# Altium project CPCIS_PWR_MOD_DC.PrjPCB (part 2 of 2)

## Sheet PWR_Stage.SchDoc
size 420 x 297 mm
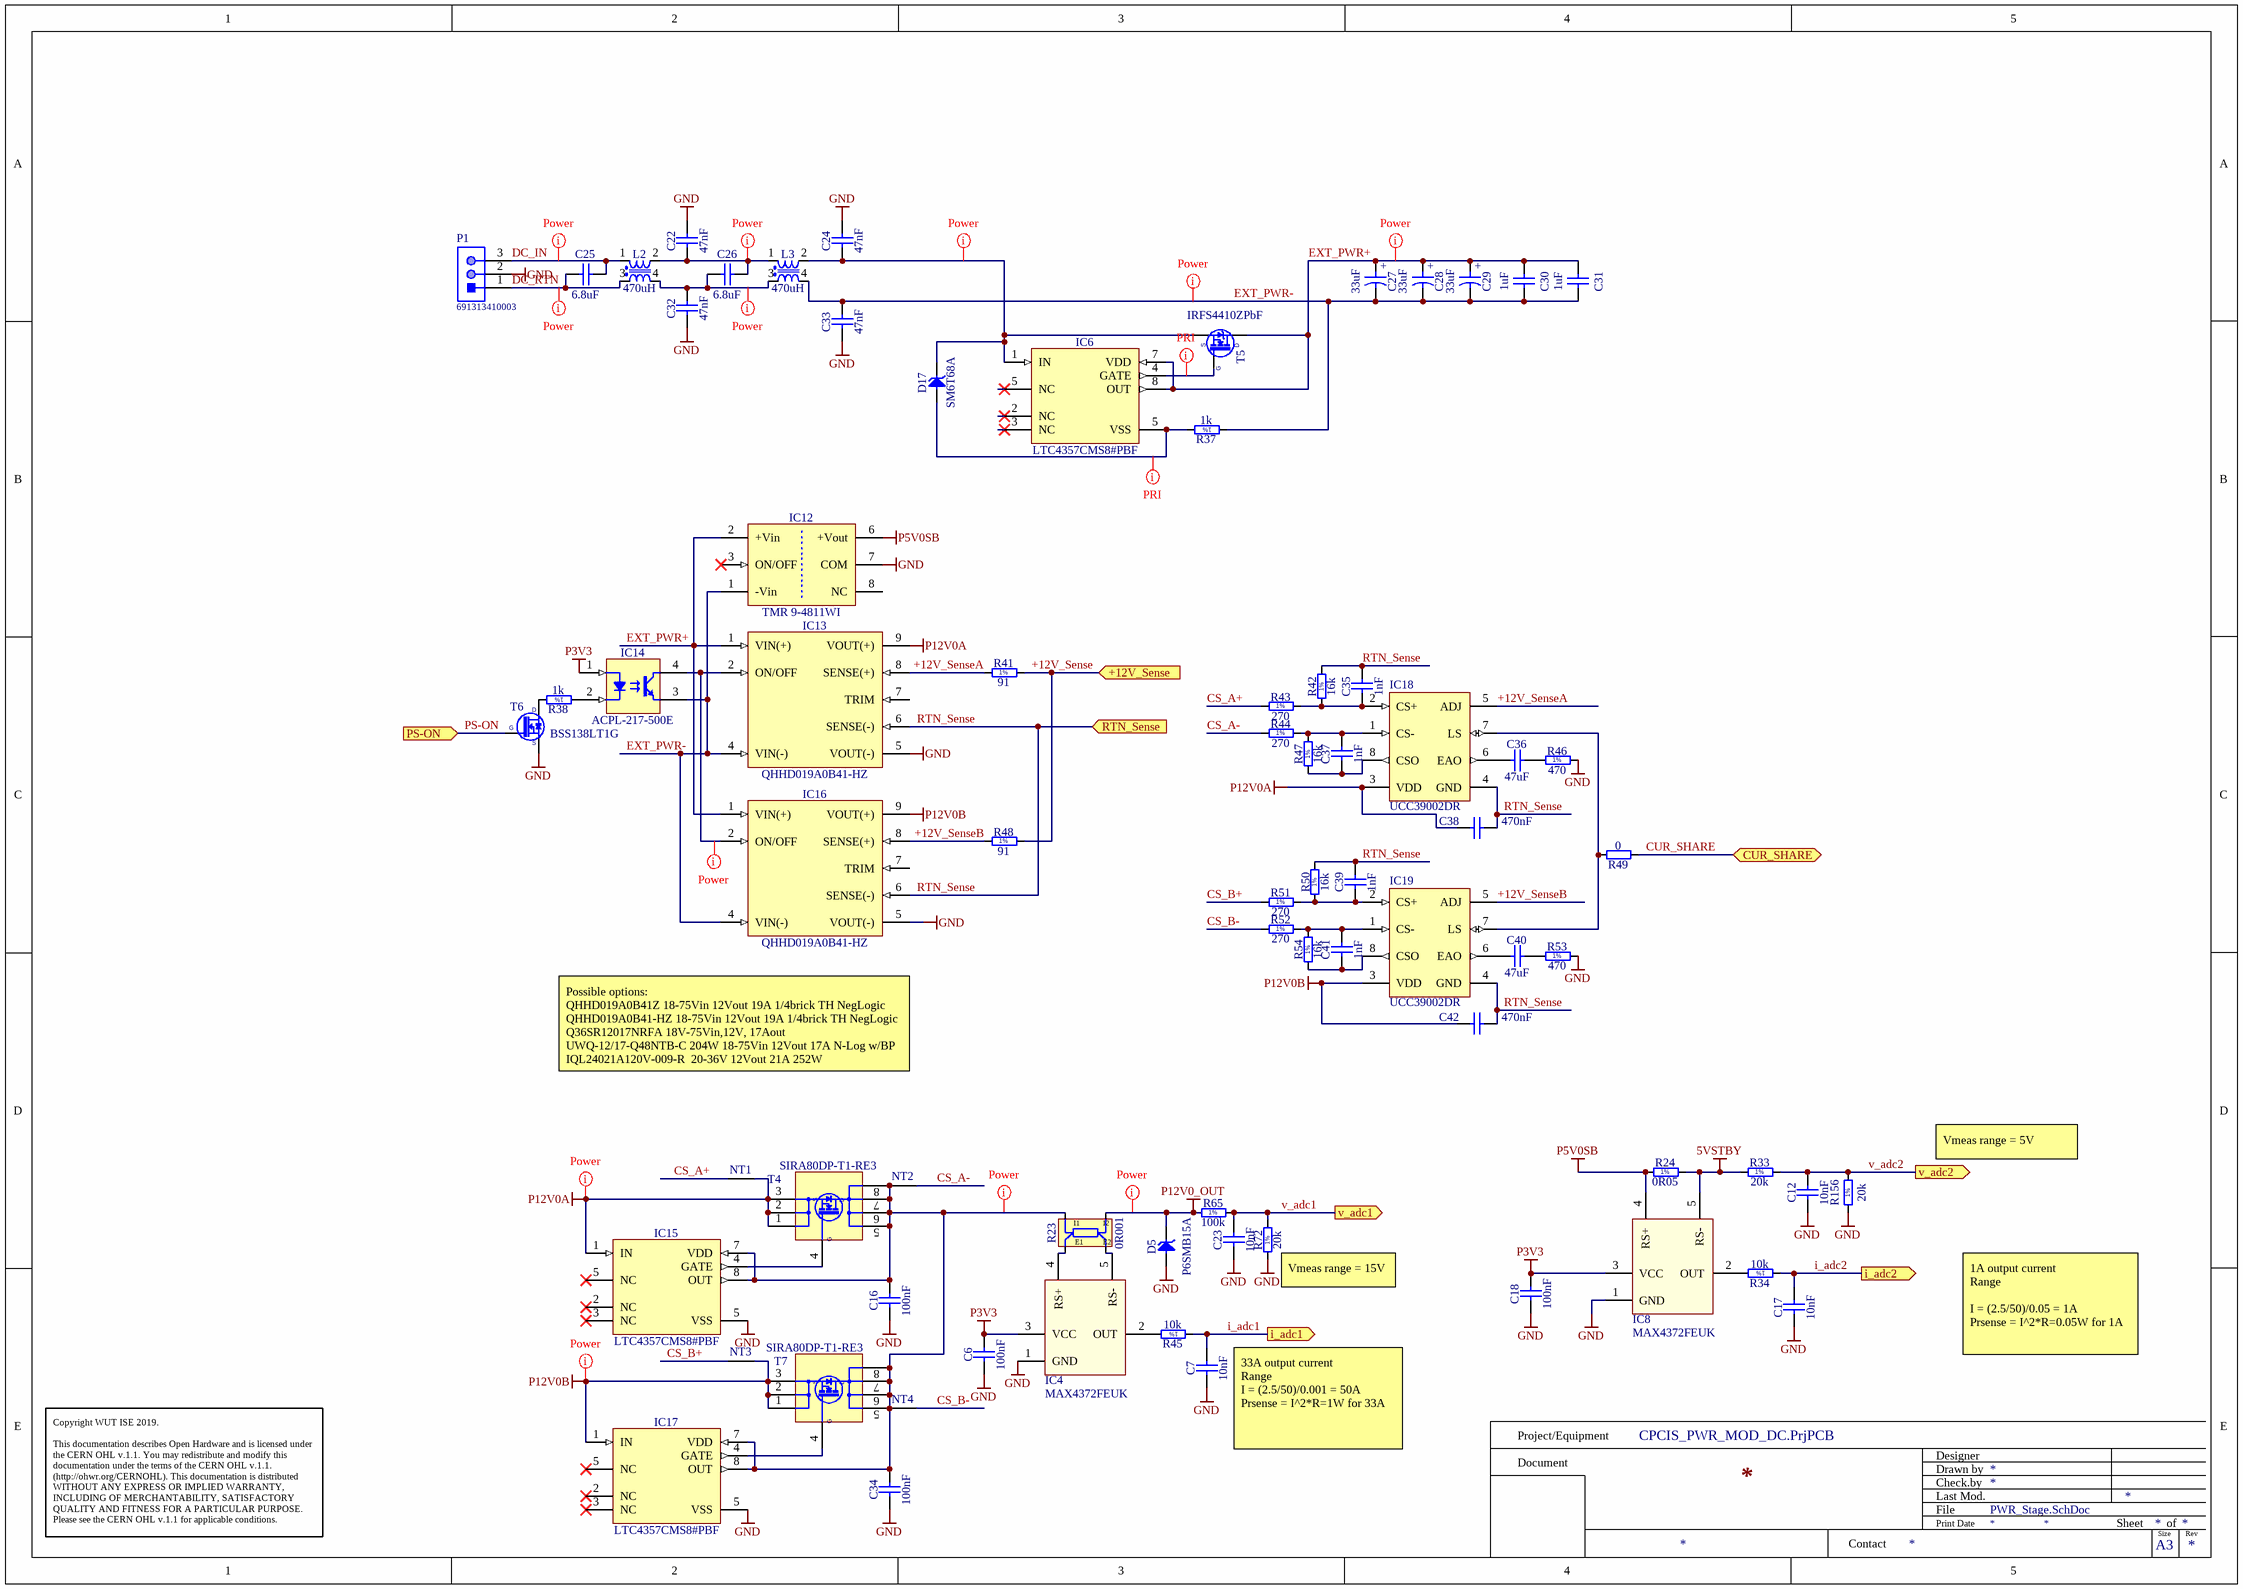
[diagram p1: PWR_Stage.SchDoc]

### Parts
C6  100nF  [CAPC1005X55N]
C7  10nF  [CAPC1005X55N]
C12  10nF  [CAPC1005X55N]
C16  100nF  [CAPC1005X55N]
C17  10nF  [CAPC1005X55N]
C18  100nF  [CAPC1005X55N]
C22  47nF  [CAPR1500-500X1800X1050]
C23  10nF  [CAPC1005X55N]
C24  47nF  [CAPR1500-500X1800X1050]
C25  6.8uF  [CAPR2750-1500X3150X2600]
C26  6.8uF  [CAPR2750-1500X3150X2600]
C27  33uF  [CAPPR500-1050X1350]
C28  33uF  [CAPPR500-1050X1350]
C29  33uF  [CAPPR500-1050X1350]
C30  1uF  [CAPR1000-520X1320X1200]
C31  1uF  [CAPR1000-520X1320X1200]
C32  47nF  [CAPR1500-500X1800X1050]
C33  47nF  [CAPR1500-500X1800X1050]
C34  100nF  [CAPC1005X55N]
C35  1nF  [CAPC1005X55N]
C36  47uF  [CAPC1608X100N]
C37  1nF  [CAPC1005X55N]
C38  470nF  [CAPC1608X87N]
C39  1nF  [CAPC1005X55N]
C40  47uF  [CAPC1608X100N]
C41  1nF  [CAPC1005X55N]
C42  470nF  [CAPC1608X87N]
D5  P6SMB15A  [DIOM5436X261N]
D17  SM6T68A  [DIOM5436X265N]
IC4  MAX4372FEUK  [SOT95P270X145-5N]
IC6  LTC4357CMS8#PBF  [SOP65P490X110-8N]
IC8  MAX4372FEUK  [SOT95P270X145-5N]
IC12  TMR 9-4811WI  [DCDC_TRACO_TMR9WI]
IC13  QHHD019A0B41-HZ  [DCDC_quad_brick]
IC14  ACPL-217-500E  [SOIC127P700X242-4N]
IC15  LTC4357CMS8#PBF  [SOP65P490X110-8N]
IC16  QHHD019A0B41-HZ  [DCDC_quad_brick]
IC17  LTC4357CMS8#PBF  [SOP65P490X110-8N]
IC18  UCC39002DR  [D0008A_N]
IC19  UCC39002DR  [D0008A_N]
L2  470uH  [IND_PULSE_BIG FOOT]
L3  470uH  [IND_PULSE_BIG FOOT]
NT1  Net Tie  [Net Tie]  (value not drawn)  (net tie, no BOM)
NT2  Net Tie  [Net Tie]  (value not drawn)  (net tie, no BOM)
NT3  Net Tie  [Net Tie]  (value not drawn)  (net tie, no BOM)
NT4  Net Tie  [Net Tie]  (value not drawn)  (net tie, no BOM)
P1  691313410003  [691313410003]
R23  0R001  [RES_VISHAY_WSL3637_0R001-0R0019]
R24  0R05  [RESC2012X60N]
R33  20k  [RESC1005X40N]
R34  10k  [RESC1005X40N]
R37  1k  [RESC3216X65N]
R38  1k  [RESC1005X40N]
R41  91  [RESC1608X55N]
R42  16k  [RESC1608X55N]
R43  270  [RESC1608X55N]
R44  270  [RESC1608X55N]
R45  10k  [RESC1005X40N]
R46  470  [RESC1005X40N]
R47  16k  [RESC1608X55N]
R48  91  [RESC1608X55N]
R49  0  [RESC1608X55N]
R50  16k  [RESC1608X55N]
R51  270  [RESC1608X55N]
R52  270  [RESC1608X55N]
R53  470  [RESC1005X40N]
R54  16k  [RESC1608X55N]
R65  100k  [RESC1005X40N]
R72  20k  [RESC1005X40N]
R156  20k  [RESC1005X40N]
T4  SIRA80DP-T1-RE3  [VISHAY_POWERPAK-SO-8-SINGLE]
T5  IRFS4410ZPbF  [TO254P1524X483-3N-R1067X686]
T6  BSS138LT1G  [SOT95P240X110-3N]
T7  SIRA80DP-T1-RE3  [VISHAY_POWERPAK-SO-8-SINGLE]

### Ports
+12V_Sense (in), CUR_SHARE (bidir), i_adc1 (out), i_adc2 (out), PS-ON (in), RTN_Sense (in), v_adc1 (out), v_adc2 (out)

### Nets
5VSTBY: IC8.5(RS-) R24.2 R33.1
GND: C6.1 C7.1 C12.1 C16.1 C17.1 C18.1 C22.2 C23.1 C24.2 C32.1 C33.1 C34.1 D5.2(A) IC4.1(GND) IC8.1(GND) IC12.7(COM) IC13.5(VOUT(-)) IC15.5(NC) IC16.5(VOUT(-)) IC17.5(NC) P1.2 R46.2 R53.2 R72.1 R156.1 T6.2(S)
P3V3: C6.2 C18.2 IC4.3(VCC) IC8.3(VCC) IC14.1(A)
P5V0SB: IC8.4(RS+) IC12.6(+Vout) R24.1
P12V0_OUT: D5.1(C) R23.I2 R65.1
P12V0A: C38.2 IC13.9(VOUT(+)) IC15.1(IN) IC18.3(VDD) NT1.2 T4.1(S) T4.2(S) T4.3(S)
P12V0B: C42.2 IC16.9(VOUT(+)) IC17.1(IN) IC19.3(VDD) NT3.2 T7.1(S) T7.2(S) T7.3(S)
+12V_Sense: R41.2 R48.2 ; port +12V_Sense
+12V_SenseA: IC13.8(SENSE(+)) IC18.5(ADJ) R41.1
+12V_SenseB: IC16.8(SENSE(+)) IC19.5(ADJ) R48.1
CS_A+: NT1.1 R43.1
CS_A-: NT2.2 R44.1
CS_B+: NT3.1 R51.1
CS_B-: NT4.2 R52.1
CUR_SHARE: R49.1 ; port CUR_SHARE
DC_IN: C25.2 L2.1 P1.3
DC_RTN: C25.1 L2.3 P1.1
EXT_PWR+: C27.1 C28.1 C29.1 C30.1 C31.1 IC6.7(VDD) IC6.8(OUT) IC12.2(+Vin) IC13.1(VIN(+)) IC16.1(VIN(+)) T5.3(D)
EXT_PWR-: C27.2 C28.2 C29.2 C30.2 C31.2 C33.2 IC12.1(-Vin) IC13.4(VIN(-)) IC14.3(E) IC16.4(VIN(-)) L3.4 R37.1
i_adc1: C7.2 R45.1 ; port i_adc1
i_adc2: C17.2 R34.1 ; port i_adc2
PS-ON: T6.1(G) ; port PS-ON
RTN_Sense: C35.2 C38.1 C39.2 C42.1 IC13.6(SENSE(-)) IC16.6(SENSE(-)) IC18.4(GND) IC19.4(GND) R42.2 R50.2 ; port RTN_Sense
v_adc1: C23.2 R65.2 R72.2 ; port v_adc1
v_adc2: C12.2 R33.2 R156.2 ; port v_adc2
NetC16_2: C16.2 C34.2 IC15.7(VDD) IC15.8(OUT) IC17.7(VDD) IC17.8(OUT) NT2.1 NT4.1 R23.I1 T4.D T7.D
NetC22_1: C22.1 C26.2 L2.2 L3.1
NetC24_1: C24.1 D17.1(C) IC6.1(IN) L3.2 T5.2(S)
NetC26_1: C26.1 C32.2 L2.4 L3.3
NetC35_1: C35.1 IC18.2(CS+) R42.1 R43.2
NetC36_1: C36.1 IC18.6(EAO)
NetC36_2: C36.2 R46.1
NetC37_1: C37.1 IC18.8(CSO) R47.1
NetC37_2: C37.2 IC18.1(CS-) R44.2 R47.2
NetC39_1: C39.1 IC19.2(CS+) R50.1 R51.2
NetC40_1: C40.1 IC19.6(EAO)
NetC40_2: C40.2 R53.1
NetC41_1: C41.1 IC19.8(CSO) R54.1
NetC41_2: C41.2 IC19.1(CS-) R52.2 R54.2
NetD17_2: D17.2(A) IC6.5(NC) R37.2
NetIC4_2: IC4.2(OUT) R45.2
NetIC4_4: IC4.4(RS+) R23.E1
NetIC4_5: IC4.5(RS-) R23.E2
NetIC6_4: IC6.4(GATE) T5.1(G)
NetIC8_2: IC8.2(OUT) R34.2
NetIC13_2: IC13.2(ON/OFF) IC14.4(C) IC16.2(ON/OFF)
NetIC14_2: IC14.2(C) R38.1
NetIC15_4: IC15.4(GATE) T4.4(S)
NetIC17_4: IC17.4(GATE) T7.4(S)
NetIC18_7: IC18.7(LS) IC19.7(LS) R49.2
NetR38_2: R38.2 T6.3(D)

Not connected (* = marked no-connect by the designer): IC6 2(NC)* 3(NC)*; IC12 3(ON/OFF)* 8(NC); IC13 7(TRIM); IC15 2(NC)* 3(NC)*; IC16 7(TRIM); IC17 2(NC)* 3(NC)*

### Layout directives
net class Power: NetC16_2, P12V0_OUT, P12V0A, P12V0B
net class Power; net class PRI: DC_IN, DC_RTN, EXT_PWR+, EXT_PWR-, NetC22_1, NetC24_1, NetC26_1, NetIC13_2
net class PRI: NetD17_2, NetIC6_4

### Notes on the sheet
- Possible options:
  QHHD019A0B41Z 18-75Vin 12Vout 19A 1/4brick TH NegLogic
  QHHD019A0B41-HZ 18-75Vin 12Vout 19A 1/4brick TH NegLogic
  Q36SR12017NRFA 18V-75Vin,12V, 17Aout
  UWQ-12/17-Q48NTB-C 204W 18-75Vin 12Vout 17A N-Log w/BP
  IQL24021A120V-009-R  20-36V 12Vout 21A 252W
- Vmeas range = 5V
- (near R72) Vmeas range = 15V
- 1A output current
  Range
  I = (2.5/50)/0.05 = 1A
  Prsense = I^2*R=0.05W for 1A
- (near C7) 33A output current
  Range
  I = (2.5/50)/0.001 = 50A
  Prsense = I^2*R=1W for 33A
- Project/Equipment
- Document
- Designer
- Drawn by
- Check.by
- Copyright WUT ISE 2019.
  This documentation describes Open Hardware and is licensed under the CERN OHL v.1.1. You may redistribute and modify this documentation under the terms of the CERN OHL v.1.1. (http://ohwr.org/CERNOHL). This documentation is distributed WITHOUT ANY EXPRESS OR IMPLIED WARRANTY, INCLUDING OF MERCHANTABILITY, SATISFACTORY QUALITY AND FITNESS FOR A PARTICULAR PURPOSE. Please see the CERN OHL v.1.1 for applicable conditions.
- Contact
- File
- Last Mod.
- Print Date
- Sheet
- Size
- A3
- of
- Rev
- (in symbol CAER_33UF_100V_20%_PANASONIC_EEUFC2A330) +
- (in symbol Q_SIRA80DP-T1-RE3) 7; 6; G; 5
- (in symbol R0402_1K_1%_0.0625W_100PPM) 1%
- (in symbol R0402_10K_1%_0.0625W_100PPM) 1%
- (in symbol R0402_20K_1%_0.0625W_100PPM) 1%
- (in symbol R0402_100K_1%_0.0625W_100PPM) 1%
- (in symbol R0402_470R_1%_0.0625W_100PPM) 1%
- (in symbol R0603_16K_1%_0.1W_100PPM) 1%
- (in symbol R0603_91R_1%_0.1W_100PPM) 1%
- (in symbol R0603_270R_1%_0.1W_100PPM) 1%
- (in symbol R0805_0R05_1%_0.25W_300PPM) 1%
- (in symbol R1206_1K_1%_0.25W_100PPM) 1%

### Library data of the parts
C6 C16 C18 C34 = CC0402_100NF_25V_10%_X7R_YUDEN_TMK105B7104KVHF: Non-polarised capacitor; Part Description: SMD Multilayer Chip Ceramic Capacitor (High Dielectric Type) for Automotive / Industrial Applications; Manufacturer: TAIYO YUDEN; Voltage: 25V; TC: X7R; Tolerance: ±10%; Part Number: CC0402_100NF_25V_10%_X7R_YUDEN_TMK105B7104KVHF; Component Kind: Standard; Component Type: Standard; Pin Count: 2; Value: 100nF; Status: Not Recommended; Manufacturer Part Number: TMK105B7104KVHF; Case: 0402; Mounted: Yes; Socket: No; SMD: Yes; Sense: No; HelpURL: \\cern.ch\dfs\Applications\Altium\Datasheets\CC0402_TAIYO-YUDEN_TMK105B7104KVHF.pdf; Author: CERN DEM JLC; CreateDate: 10/05/2017; LatestRevisionDate: 10/05/2017; ComponentHeight: 0.55mm
C7 C12 C17 C23 = CC0402_10NF_50V_10%_X7R: Non-polarised capacitor; Part Description: SMD Multilayer Chip Ceramic Capacitor; Manufacturer: GENERIC; Manufacturer1 Part Number: GRM155R71H103KA88D; Voltage: 50V; TC: X7R; Tolerance: ±10%; Part Number: CC0402_10NF_50V_10%_X7R; Component Kind: Standard; Component Type: Standard; Pin Count: 2; Value: 10nF; Status: None; Manufacturer Part Number: CC0402_10NF_50V_10%_X7R; Case: 0402; Mounted: Yes; Socket: No; SMD: Yes; Sense: No; Manufacturer1 Example: MURATA; Manufacturer1 ComponentHeight: 0.55mm; HelpURL: \\cern.ch\dfs\Applications\Altium\Datasheets\CC0402_X7R_MURATA_GRM.pdf; Author: CERN DEM MR; CreateDate: 08/01/2016; LatestRevisionDate: 08/01/2016
C22 C24 C32 C33 = CPPR_47NF_630V_5%_1500-500X1800X1050: Non-polarised capacitor; Part Description: Metallized Polypropylene Film Capacitor (MKP); Manufacturer: TDK; Manufacturer Part Number: B32652A6473J000; Voltage: 630VDC/250VAC; Tolerance: ±5%; Part Number: CPPR_47NF_630V_5%_1500-500X1800X1050; Component Kind: Standard; Component Type: Standard; Pin Count: 2; Value: 47nF; Status: None; Case: LS15 W5 x L18 x H10.5; Mounted: Yes; Socket: No; SMD: No; Sense: No; ComponentHeight: 10.5mm; HelpURL: \\cern.ch\dfs\Applications\Altium\Datasheets\CPPR_TDK_B32652.pdf; Author: CERN DEM JLC; CreateDate: 20.12.2007; LatestRevisionDate: 22.04.2015
C25 C26 = CPPR_6.8UF_100V_20%_2750-1500X3150X2600: Non-polarised capacitor; Part Description: Metallized Polypropylene Film Capacitor (MKP4); Manufacturer: WIMA; Manufacturer Part Number: MKP4D046806F00MSSD; Voltage: 100VDC/63VAC; Tolerance: ±20%; Part Number: CPPR_6.8UF_100V_20%_2750-1500X3150X2600; Component Kind: Standard; Component Type: Standard; Pin Count: 2; Value: 6.8uF; Status: None; Case: LS27.5 W15 x L31.5 x H26; Mounted: Yes; Socket: No; SMD: No; Sense: No; ComponentHeight: 26mm; HelpURL: \\cern.ch\dfs\Applications\Altium\Datasheets\CPPR_WIMA_MKP4.pdf; Author: CERN DEM JLC; CreateDate: 12.05.2014; LatestRevisionDate: 12.05.2014
C27-C29 = CAER_33UF_100V_20%_PANASONIC_EEUFC2A330: Polarised capacitor; Part Description: Z= 0R53, Radial Lead, Aluminum Electrolytic Capacitor, (FC Series, Type A, Automotive Compliant); Voltage: 100V; Tolerance: ±20%; Part Number: CAER_33UF_100V_20%_PANASONIC_EEUFC2A330; Component Kind: Standard; Component Type: Standard; Pin Count: 2; Value: 33uF; Status: None; Manufacturer: PANASONIC; Manufacturer Part Number: EEUFC2A330; Case: LS5 D10 x H12.5; Mounted: Yes; Socket: No; SMD: No; Sense: No; ComponentHeight: 13.5mm; HelpURL: \\cern.ch\dfs\Applications\Altium\Datasheets\CAER_PANASONIC_FC-A.pdf; Author: CERN DEM JLC; CreateDate: 22.03.2016; LatestRevisionDate: 23.01.2018
C30 C31 = CPER_1UF_100V_5%_KEMET_R60: Non-polarised capacitor; Part Description: Metallized Polyester Film Capacitor; Manufacturer: KEMET; Manufacturer Part Number: R60EF4100506AJ; Voltage: 100V; Tolerance: ±5%; Part Number: CPER_1UF_100V_5%_KEMET_R60; Component Kind: Standard; Component Type: Standard; Pin Count: 2; Value: 1uF; Status: None; Case: LS10 W5 x L13 x H11; Mounted: Yes; Socket: No; SMD: No; Sense: No; ComponentHeight: 12mm; HelpURL: \\cern.ch\dfs\Applications\Altium\Datasheets\CPER_KEMET_R60.pdf; Author: CERN DEM JLC; CreateDate: 11.02.2015; LatestRevisionDate: 11.02.2015
C35 C37 C39 C41 = CC0402_1NF_50V_10%_X7R: Non-polarised capacitor; Part Description: SMD Multilayer Chip Ceramic Capacitor; Manufacturer: GENERIC; Manufacturer1 Part Number: 223858715623; Voltage: 50V; TC: X7R; Tolerance: ±10%; Part Number: CC0402_1NF_50V_10%_X7R; Component Kind: Standard; Component Type: Standard; Pin Count: 2; Value: 1nF; Status: Not Recommended; Manufacturer Part Number: CC0402_1NF_50V_10%_X7R; Case: 0402; Mounted: Yes; Socket: No; SMD: Yes; Sense: No; Manufacturer1 Example: PHYCOMP; Manufacturer1 ComponentHeight: 0.55mm; HelpURL: \\cern.ch\dfs\Applications\Altium\Datasheets\CC0402_X7R_PHYCOMP.pdf; Author: CERN DEM JLC; CreateDate: 03.12.2007; LatestRevisionDate: 03.12.2007
C36 C40 = CC0603_47UF_6.3V_20%_X5R: Non-polarised capacitor; Part Description: SMD Multilayer Chip Ceramic Capacitor; Manufacturer: GENERIC; Manufacturer1 Part Number: GRM188R60J476ME15D; Voltage: 6.3V; TC: X5R; Tolerance: ±20%; Part Number: CC0603_47UF_6.3V_20%_X5R; Component Kind: Standard; Component Type: Standard; Pin Count: 2; Value: 47uF; Status: None; Manufacturer Part Number: CC0603_47UF_6.3V_20%_X5R; Case: 0603; Mounted: Yes; Socket: No; SMD: Yes; Sense: No; Manufacturer1 Example: MURATA; Manufacturer1 ComponentHeight: 1mm; HelpURL: \\cern.ch\dfs\Applications\Altium\Datasheets\CC0603_MURATA_GRM188R60J476ME15D.pdf; Author: CERN DEM JLC; CreateDate: 01.02.2018; LatestRevisionDate: 01.02.2018
C38 C42 = CC0603_470NF_50V_10%_X5R: Non-polarised capacitor; Part Description: SMD Multilayer Chip Ceramic Capacitor; Manufacturer: GENERIC; Manufacturer1 Part Number: C1608X5R1H474K080; Voltage: 50V; TC: X5R; Tolerance: ±10%; Part Number: CC0603_470NF_50V_10%_X5R; Component Kind: Standard; Component Type: Standard; Pin Count: 2; Value: 470nF; Status: None; Manufacturer Part Number: CC0603_470NF_50V_10%_X5R; Case: 0603; Mounted: Yes; Socket: No; SMD: Yes; Sense: No; Manufacturer1 Example: TDK; Manufacturer1 ComponentHeight: 0.9mm; HelpURL: \\cern.ch\dfs\Applications\Altium\Datasheets\CC0603_X5R_TDK_C.pdf; Author: CERN DEM MR; CreateDate: 29.02.2016; LatestRevisionDate: 29.02.2016
D5 = P6SMB15A: Transient Voltage Suppressor Diode (Uni-Directional); Part Description: Uni-directional Transient Voltage Suppressor (TVS) Diode; Manufacturer: LITTELFUSE; Voltage: 15V; Power: 600W; PressFit: No; Bonding: No; Part Number: P6SMB15A; Component Kind: Standard; Component Type: Standard; Device: P6SMB15A; PackageDescription: DO-214-AA/SMB Diode, Molded Body; 5.40mm L X 3.62mm W X 2.61mm H, IPC Medium Density; Manufacturer Part Number: P6SMB15A; Pin Count: 2; Case: SMB; Mounted: Yes; Socket: No; SMD: Yes; Sense: No; ComponentHeight: 2.61mm; HelpURL: \\cern.ch\dfs\Applications\Altium\Datasheets\P6SMB15A.pdf; Author: CERN DEM JLC; CreateDate: 12.07.2017; LatestRevisionDate: 12.07.2017
D17 = SM6T68A: Transient Voltage Suppressor Diode (Uni-Directional); Part Description: Uni-Directional Transient Voltage Suppressor Diode; Manufacturer: ST MICROELECTRONICS; Voltage: 68V; Power: 600W; PressFit: No; Bonding: No; Part Number: SM6T68A; Component Kind: Standard; Component Type: Standard; Device: SM6T68A; PackageDescription: DO-214-AA/SMB Molded Diode, Body 5.4x3.6mm, IPC Medium Density; Manufacturer Part Number: SM6T68A; Pin Count: 2; Case: DO-214AA; Mounted: Yes; Socket: No; SMD: Yes; Sense: No; ComponentHeight: 2.65mm; HelpURL: \\cern.ch\dfs\Applications\Altium\Datasheets\SM6T68A.pdf; Author: CERN DEM JLC; CreateDate: 05.10.2011; LatestRevisionDate: 05.10.2011
IC4 IC8 = PM_MAX4372FEUK: Manufacturer: Maxim; Part Description: High side current sense amplifier (x50); Bonding: No; PressFit: No; Case: SOT23-5; Component Kind: Standard; Component Type: Standard; ComponentHeigth: *; CreateDate: 2018-01-01; Device: MAX4372FEUK; Footprint: SOT23-5; HelpURL: *; LatestRevisionDate: 2018-01-01; Manufacturer Part Number: MAX4372FEUK; Mounted: Yes; PackageDescription: SOT23-5; Part Number: MAX4372FEUK; Pin Count: 5; Sense: No; SMD: Yes; Socket: No; Value: MAX4372FEUK
IC6 IC15 IC17 = LTC4357CMS8#PBF: Positive High Voltage Ideal Diode Controller; Manufacturer: LINEAR TECHNOLOGY; PressFit: No; Bonding: No; Part Number: LTC4357CMS8#PBF; Component Kind: Standard; Component Type: Standard; Device: LTC4357CMS8#PBF; PackageDescription: SOP, 0.65mm, Pitch; 8 Pin, 3.0mm W X 3.0mm L X 1.10mm H Body, IPC Medium Density; Part Description: Positive High Voltage Ideal Diode Controller; Manufacturer Part Number: LTC4357CMS8#PBF; Pin Count: 8; Case: MSOP8; Mounted: Yes; Socket: No; SMD: Yes; Sense: No; ComponentHeight: 1.1mm; Author: GK; HelpURL: \\cern.ch\dfs\Applications\Altium\Datasheets\LTC4359CMS8#PBF.pdf; CreateDate: 25.02.2015; LatestRevisionDate: 25.02.2015
IC12 = DCDC_TRACO_TMR9WI: 18-75VDC to 5VDC, Iout (max) 1600mA, 9W DC-DC Converter; Manufacturer: TRACO POWER; PressFit: No; Bonding: No; Part Number: TMR 9-4811WI; Component Kind: Standard; Component Type: Standard; Device: TMR 9-4811WI; PackageDescription: TMR 9 WI Series, Body 21.8x9.6mm, Compact SIP-8 Package; Part Description: 18-75VDC to 5VDC, Iout (max) 1600mA, 9W DC-DC Converter; Manufacturer Part Number: TMR 9-4811WI; Pin Count: 6; Mounted: Yes; Socket: No; SMD: No; Sense: No; ComponentHeight: 11.7mm; HelpURL: \\cern.ch\dfs\Applications\Altium\Datasheets\TMR 9-4822WI.pdf; Author: GK; CreateDate: 01.01.2020; LatestRevisionDate: 01.01.2020
IC13 IC16 = DCDC_ABB_QHHD019A0B: 18 - 75V to 12V 19A, 225W  DC/DC Power Module; Part Description: 18 - 75V; Manufacturer: ABB Power Electronics Inc.; PressFit: No; Bonding: No; Part Number: QHHD019A0B41-HZ; Component Kind: Standard; Component Type: Standard; Device: QHHD019A0B41-HZ; PackageDescription: 18 - 75V to 12V 19A, 225W  DC/DC Power Module; Manufacturer Part Number: QHHD019A0B41-HZ; Pin Count: 9; Mounted: Yes; Socket: No; SMD: No; Sense: No; ComponentHeight: 12.7mm; HelpURL: \\cern.ch\dfs\Applications\Altium\Datasheets\Q48SC12033NRDH.pdf; Author: GK; CreateDate: 02.01.2020; LatestRevisionDate: 02.01.2020
IC14 = ACPL-217-500E: Single Optocoupler; Part Description: DC Input, Half-Pitch Phototransistor Optocoupler; Manufacturer: AVAGO TECHNOLOGIES; PressFit: No; Bonding: No; Part Number: ACPL-217-500E; Component Kind: Standard; Component Type: Standard; Device: ACPL-217-500E; PackageDescription: SOIC, 1.27mm, pitch; 4 pin, 2.60mm W X 4.40mm L X 2.42mm H body, IPC Medium Density; Status: Not Recommended; Manufacturer Part Number: ACPL-217-500E; Pin Count: 4; Case: SOIC4; Mounted: Yes; Socket: No; SMD: Yes; Sense: No; ComponentHeight: 2.42mm; HelpURL: \\cern.ch\dfs\Applications\Altium\Datasheets\ACPL-217-500E.pdf; Author: CERN DEM JLC; CreateDate: 11.11.2014; LatestRevisionDate: 11.11.2014
IC18 IC19 = CMP-0335-00043-2: Advanced Loadshare Controller with UVLO, 4.375 to 14.25 V Supply, 0 to 70 degC, 8-pin SOIC (D), Green (RoHS & no Sb/Br); Manufacturer: Texas Instruments; Share Bus: Single-Ended; Operating Supply Current(mA): 2.5; Rating: Catalog; Operating Supply(Min)(V): 4.375; UVLO: TRUE; Operating Supply(Max)(V): 14.25; Startup Current(uA): 2500; DatasheetVersion: SLUS495H; ComponentLink1URL: http://www.ti.com/general/docs/lit/getliterature.tsp?genericPartNumber=UCC39002&fileType=pdf; PackageReference: D0008A; ComponentLink1Description: Datasheet; Mounting Technology: Surface Mount; PackageVersion: revM, Jun-2011; SubFamily: Load Share; Code_JEDEC: MS-012AA; PartNumber: UCC39002DR; PackageDescription: 8-Pin Plastic Small Outline Integrated Circuit, 4.9 x 3.9 mm, Pitch 1.27 mm Pitch; Eco-Plan: Green (RoHS & no Sb/Br)
L2 L3 = IND_470UH_35%_PULSE_P0502NL: Inductor Common Mode; Part Description: SMT Common Mode Choke; Manufacturer: PULSE ELECTRONICS; Power: 14A; Resistance: 0.008R; Tolerance: ±35%; Part Number: IND_470UH_35%_PULSE_P0502NL; Component Kind: Standard; Component Type: Standard; Pin Count: 2; Value: 470uH; Status: None; Manufacturer Part Number: P0502NL; Mounted: Yes; Socket: No; SMD: Yes; Sense: No; ComponentHeight: 12.7mm; HelpURL: \\cern.ch\dfs\Applications\Altium\Datasheets\IND_PULSE_P0502NL.pdf; Author: CERN DEM JLC; CreateDate: 31.01.2017; LatestRevisionDate: 31.01.2017
NT1-NT4 = Net Tie: Part Description: Net Tie (2 Nets); Mounted: No; Part Number: Net Tie; Component Type: Net Tie; Pin Count: 2; Family: Net Tie; Socket: No; SMD: No; Sense: No; Status: None; ComponentHeight: 0mm; HelpURL: Undefined; Author: CERN DEM JLC; CreateDate: 22.03.2011; LatestRevisionDate: 22.03.2011; PackageDescription: 2 Plated Through Hole For Coaxial Cable Link: Hole Dia.=1.4mm Pad Dia.=2.5mm
P1 = CMP-1502-02425-1: Serie 3134 - 7.62mm Close Horizontal PCB Header WR-TBL, 3 pin; Manufacturer: Wurth Elektronik; Gender: Male; Pin Number: 3; Operating Temperature: -40to105degC; Package Reference: 691313410003; Packaging: Box; Mounting Technology: THT; Publisher: WurthElektronik; Part Number: 691313410003; Datasheet URL: http://katalog.we-online.de/em/datasheet/6913134100xx.pdf; Pitch: 7.62mm; Manufacturer URL: http://www.we-online.de
R23 = R3637_0R001_1%_3W_50PPM_VISHAY_WSL3637: Power and Current Sensing Resistor; Part Description: Power Metal Strip® Resistor, Low Value; Manufacturer: VISHAY DALE; Manufacturer Part Number: WSL36371L000FEA; Power: 3W; TC: ±75ppm/°C; Tolerance: ±1%; PressFit: No; Part Number: R3637_0R001_1%_3W_50PPM_VISHAY_WSL3637; Component Kind: Standard; Component Type: Standard; Pin Count: 4; Value: 0R001; Status: None; Case: 3637; Mounted: Yes; Sense: No; Socket: No; SMD: Yes; ComponentHeight: 0.89mm; HelpURL: \\cern.ch\dfs\Applications\Altium\Datasheets\R3637_VISHAY_WSL3637.pdf; Author: CERN DEM MR; CreateDate: 02.06.2016; LatestRevisionDate: 02.06.2016
R24 = R0805_0R05_1%_0.25W_300PPM: Resistor - 1%; Part Description: Low Resistance Thick Film Chip Resistor; Manufacturer: GENERIC; Manufacturer1 Part Number: 235051117500L or RL0805FR-7W0R05L; Power: 0.25W; TC: ±300ppm/°C; PressFit: No; Part Number: R0805_0R05_1%_0.25W_300PPM; Component Kind: Standard; Component Type: Standard; Pin Count: 2; Value: 0R05; Status: Not Recommended; Tolerance: ±1%; Manufacturer Part Number: R0805_0R05_1%_0.25W_300PPM; Case: 0805; Mounted: Yes; Sense: No; Socket: No; SMD: Yes; Manufacturer1 Example: YAGEO PHYCOMP; Manufacturer1 ComponentHeight: 0.60mm; HelpURL: \\cern.ch\dfs\Applications\Altium\Datasheets\R0805_Phycomp_RL0805.pdf; Author: CERN DEM MR; CreateDate: 31.03.2016; LatestRevisionDate: 31.03.2016
R33 R72 R156 = R0402_20K_1%_0.0625W_100PPM: Resistor - 1%; Part Description: General Purpose Thick Film Chip Resistor; Manufacturer: GENERIC; Manufacturer1 Part Number: 232270672003L; TC: ±100ppm/°C; PressFit: No; Part Number: R0402_20K_1%_0.0625W_100PPM; Component Kind: Standard; Component Type: Standard; Pin Count: 2; Value: 20k; Status: Not Recommended; Power: 0.0625W; Tolerance: ±1%; Manufacturer Part Number: R0402_20K_1%_0.0625W_100PPM; Case: 0402; Mounted: Yes; Sense: No; Socket: No; SMD: Yes; Manufacturer1 Example: YAGEO PHYCOMP; Manufacturer1 ComponentHeight: 0.4mm; HelpURL: \\cern.ch\dfs\Applications\Altium\Datasheets\R0402_Phycomp_RC0402.pdf; Author: CERN DEM JLC; CreateDate: 03.12.2007; LatestRevisionDate: 17.10.2012
R34 R45 = R0402_10K_1%_0.0625W_100PPM: Resistor - 1%; Part Description: General Purpose Thick Film Chip Resistor; Manufacturer: GENERIC; Manufacturer1 Part Number: 232270671003L; TC: ±100ppm/°C; PressFit: No; Part Number: R0402_10K_1%_0.0625W_100PPM; Component Kind: Standard; Component Type: Standard; Pin Count: 2; Value: 10k; Status: Not Recommended; Power: 0.0625W; Tolerance: ±1%; Manufacturer Part Number: R0402_10K_1%_0.0625W_100PPM; Case: 0402; Mounted: Yes; Sense: No; Socket: No; SMD: Yes; Manufacturer1 Example: YAGEO PHYCOMP; Manufacturer1 ComponentHeight: 0.4mm; HelpURL: \\cern.ch\dfs\Applications\Altium\Datasheets\R0402_Phycomp_RC0402.pdf; Author: CERN DEM JLC; CreateDate: 03/12/2007; LatestRevisionDate: 17/10/2012
R37 = R1206_1K_1%_0.25W_100PPM: Resistor - 1%; Part Description: General Purpose Thick Film Chip Resistor; Manufacturer: GENERIC; Manufacturer1 Part Number: NRC12F1001TRF; Power: 0.25W; TC: ±100ppm/°C; PressFit: No; Part Number: R1206_1K_1%_0.25W_100PPM; Component Kind: Standard; Component Type: Standard; Pin Count: 2; Value: 1k; Status: Preferred; Tolerance: ±1%; Manufacturer Part Number: R1206_1K_1%_0.25W_100PPM; Case: 1206; Mounted: Yes; Sense: No; Socket: No; SMD: Yes; Manufacturer1 Example: NIC COMPONENT; Manufacturer1 ComponentHeight: 0.65mm; HelpURL: \\cern.ch\dfs\Applications\Altium\Datasheets\R1206_NIC_NRC.pdf; Author: CERN DEM JLC; CreateDate: 03.12.2007; LatestRevisionDate: 13.03.2008
R38 = R0402_1K_1%_0.0625W_100PPM: Resistor - 1%; Part Description: General Purpose Thick Film Chip Resistor; Manufacturer: GENERIC; Manufacturer1 Part Number: 232270671002L; TC: ±100ppm/°C; PressFit: No; Part Number: R0402_1K_1%_0.0625W_100PPM; Component Kind: Standard; Component Type: Standard; Pin Count: 2; Value: 1k; Status: Not Recommended; Power: 0.0625W; Tolerance: ±1%; Manufacturer Part Number: R0402_1K_1%_0.0625W_100PPM; Case: 0402; Mounted: Yes; Sense: No; Socket: No; SMD: Yes; Manufacturer1 Example: YAGEO PHYCOMP; Manufacturer1 ComponentHeight: 0.4mm; HelpURL: \\cern.ch\dfs\Applications\Altium\Datasheets\R0402_Phycomp_RC0402.pdf; Author: CERN DEM JLC; CreateDate: 03.12.2007; LatestRevisionDate: 17.10.2012
R41 R48 = R0603_91R_1%_0.1W_100PPM: Resistor - 1%; Part Description: General Purpose Thick Film Chip Resistor; Manufacturer: GENERIC; Manufacturer1 Part Number: NRC06F91R0TRF; Power: 0.1W; TC: ±100ppm/°C; PressFit: No; Part Number: R0603_91R_1%_0.1W_100PPM; Component Kind: Standard; Component Type: Standard; Pin Count: 2; Value: 91; Status: Preferred; Tolerance: ±1%; Manufacturer Part Number: R0603_91R_1%_0.1W_100PPM; Case: 0603; Mounted: Yes; Sense: No; Socket: No; SMD: Yes; Manufacturer1 Example: NIC COMPONENT; Manufacturer1 ComponentHeight: 0.55mm; HelpURL: \\cern.ch\dfs\Applications\Altium\Datasheets\R0603_NIC_NRC.pdf; Author: CERN DEM JLC; CreateDate: 03.12.2007; LatestRevisionDate: 13.03.2008
R42 R47 R50 R54 = R0603_16K_1%_0.1W_100PPM: Resistor - 1%; Part Description: General Purpose Thick Film Chip Resistor; Manufacturer: GENERIC; Manufacturer1 Part Number: NRC06F1602TRF; Power: 0.1W; TC: ±100ppm/°C; PressFit: No; Part Number: R0603_16K_1%_0.1W_100PPM; Component Kind: Standard; Component Type: Standard; Pin Count: 2; Value: 16k; Status: Preferred; Tolerance: ±1%; Manufacturer Part Number: R0603_16K_1%_0.1W_100PPM; Case: 0603; Mounted: Yes; Sense: No; Socket: No; SMD: Yes; Manufacturer1 Example: NIC COMPONENT; Manufacturer1 ComponentHeight: 0.55mm; HelpURL: \\cern.ch\dfs\Applications\Altium\Datasheets\R0603_NIC_NRC.pdf; Author: CERN DEM JLC; CreateDate: 03.12.2007; LatestRevisionDate: 13.03.2008
R43 R44 R51 R52 = R0603_270R_1%_0.1W_100PPM: Resistor - 1%; Part Description: General Purpose Thick Film Chip Resistor; Manufacturer: GENERIC; Manufacturer1 Part Number: NRC06F2700TRF; Power: 0.1W; TC: ±100ppm/°C; PressFit: No; Part Number: R0603_270R_1%_0.1W_100PPM; Component Kind: Standard; Component Type: Standard; Pin Count: 2; Value: 270; Status: Preferred; Tolerance: ±1%; Manufacturer Part Number: R0603_270R_1%_0.1W_100PPM; Case: 0603; Mounted: Yes; Sense: No; Socket: No; SMD: Yes; Manufacturer1 Example: NIC COMPONENT; Manufacturer1 ComponentHeight: 0.55mm; HelpURL: \\cern.ch\dfs\Applications\Altium\Datasheets\R0603_NIC_NRC.pdf; Author: CERN DEM JLC; CreateDate: 03.12.2007; LatestRevisionDate: 13.03.2008
R46 R53 = R0402_470R_1%_0.0625W_100PPM: Resistor - 1%; Part Description: General Purpose Thick Film Chip Resistor; Manufacturer: GENERIC; Manufacturer1 Part Number: 232270674701L; TC: ±100ppm/°C; PressFit: No; Part Number: R0402_470R_1%_0.0625W_100PPM; Component Kind: Standard; Component Type: Standard; Pin Count: 2; Value: 470; Status: Not Recommended; Power: 0.0625W; Tolerance: ±1%; Manufacturer Part Number: R0402_470R_1%_0.0625W_100PPM; Case: 0402; Mounted: Yes; Sense: No; Socket: No; SMD: Yes; Manufacturer1 Example: YAGEO PHYCOMP; Manufacturer1 ComponentHeight: 0.4mm; HelpURL: \\cern.ch\dfs\Applications\Altium\Datasheets\R0402_Phycomp_RC0402.pdf; Author: CERN DEM JLC; CreateDate: 03.12.2007; LatestRevisionDate: 17.10.2012
R49 = R0603_0R_JUMPER: Resistor; Part Description: 1A (0.05R Max DC Resistance) Zero Ohm Jumper; Manufacturer: GENERIC; Manufacturer1 Part Number: NRC06Z0; PressFit: No; Part Number: R0603_0R_JUMPER; Component Kind: Standard; Component Type: Standard; Pin Count: 2; Value: 0; Status: Preferred; Manufacturer Part Number: R0603_0R_JUMPER; Case: 0603; Mounted: Yes; Sense: No; Socket: No; SMD: Yes; Manufacturer1 Example: NIC COMPONENT; Manufacturer1 ComponentHeight: 0.55mm; HelpURL: \\cern.ch\dfs\Applications\Altium\Datasheets\R0603_NIC_NRC.pdf; Author: CERN DEM JLC; CreateDate: 03.12.2007; LatestRevisionDate: 13.03.2008
R65 = R0402_100K_1%_0.0625W_100PPM: Resistor - 1%; Part Description: General Purpose Thick Film Chip Resistor; Manufacturer: GENERIC; Manufacturer1 Part Number: 232270671004L; TC: ±100ppm/°C; PressFit: No; Part Number: R0402_100K_1%_0.0625W_100PPM; Component Kind: Standard; Component Type: Standard; Pin Count: 2; Value: 100k; Status: Not Recommended; Power: 0.0625W; Tolerance: ±1%; Manufacturer Part Number: R0402_100K_1%_0.0625W_100PPM; Case: 0402; Mounted: Yes; Sense: No; Socket: No; SMD: Yes; Manufacturer1 Example: YAGEO PHYCOMP; Manufacturer1 ComponentHeight: 0.4mm; HelpURL: \\cern.ch\dfs\Applications\Altium\Datasheets\R0402_Phycomp_RC0402.pdf; Author: CERN DEM JLC; CreateDate: 03/12/2007; LatestRevisionDate: 17/10/2012
T4 T7 = Q_SIRA80DP-T1-RE3: 100A N-Channel 30-V (D-S) MOSFET; Part Number: SI7898DP-T1-E3; Manufacturer: VISHAY SILICONIX; PressFit: No; Bonding: No; Component Kind: Standard; Component Type: Standard; Device: SIRA80DP-T1-RE3; PackageDescription: SOIC, 1.27mm Pitch, 8 Pin, Body 5.89mm W X 4.9mm L X 1.12mm H, PowerPAK® SO-8, (SINGLE); Part Description: 100A N-Channel 30-V (D-S) MOSFET; Manufacturer Part Number: SIRA80DP-T1-RE3; Pin Count: 8; Case: SOIC8; Mounted: Yes; Socket: No; SMD: Yes; Sense: No; ComponentHeight: 1.12mm; HelpURL: \\cern.ch\dfs\Applications\Altium\Datasheets\SI7898DP-T1-E3.pdf; Author: GK; CreateDate: 01.01.2020; LatestRevisionDate: 01.01.202005.03.2013
T5 = IRFS4410ZPbF: N-CHANNEL MOSFET WITH ZENER DIODE; Part Description: 100V 97A N-Channel HEXFET® Power MOSFET; Manufacturer: INTERNATIONAL RECTIFIER; PressFit: No; Bonding: No; Part Number: IRFS4410ZPbF; Component Kind: Standard; Component Type: Standard; Device: IRFS4410ZPbF; PackageDescription: D2PAK TO-263AB TO, 2.54mm pitch; 2 pin, 15.245mm L X 9.515mm W X 4.83mm H body, IPC Medium Density; Manufacturer Part Number: IRFS4410ZPbF; Pin Count: 3; Case: D2PAK; Mounted: Yes; Socket: No; SMD: Yes; Sense: No; ComponentHeight: 4.83mm; HelpURL: \\cern.ch\dfs\Applications\Altium\Datasheets\IRFS4410ZPBF.pdf; Author: CERN DEM JMW; CreateDate: 11.12.2008; LatestRevisionDate: 21.09.2009
T6 = BSS138LT1G: N-CHANNEL MOSFET WITH DIODE; Part Description: 50V 200mA N-Channel Enhancement Mode Field-Effect Transistor; Manufacturer: ON SEMICONDUCTOR; PressFit: No; Bonding: No; Part Number: BSS138LT1G; Component Kind: Standard; Component Type: Standard; Device: BSS138LT1G; PackageDescription: SOT23 3-Leads, Pitch 0.95mm - Body 1.4x3mm, IPC Medium Density; Manufacturer Part Number: BSS138LT1G; Pin Count: 3; Case: SOT23-3; Mounted: Yes; Socket: No; SMD: Yes; Sense: No; ComponentHeight: 1.11mm; HelpURL: \\cern.ch\dfs\Applications\Altium\Datasheets\BSS138LT1G.pdf; Author: CERN DEM JLC; CreateDate: 23.03.2009; LatestRevisionDate: 23.03.2009

## Nets that join several sheets
5VSTBY: CPCIS_PWR_MOD_DC (J2.C5 J2.C6 J2.D6), PWR_Stage (IC8.5 R24.2 R33.1)
GND: CPCIS_PWR_MOD_DC (69 pins), PWR_Stage (26 pins)
P3V3: CPCIS_PWR_MOD_DC (36 pins), PWR_Stage (5 pins)
P5V0SB: CPCIS_PWR_MOD_DC (C13.1 IC7.5 IC7.8), PWR_Stage (IC8.4 IC12.6 R24.1)
P12V0_OUT: CPCIS_PWR_MOD_DC (J2.P8 J2.P9), PWR_Stage (D5.1 R23.I2 R65.1)
+12V_Sense: CPCIS_PWR_MOD_DC (J2.A3), PWR_Stage (R41.2 R48.2)
CUR_SHARE: CPCIS_PWR_MOD_DC (D6.1 J2.B2 R36.2), PWR_Stage (R49.1)
i_adc1: CPCIS_PWR_MOD_DC (IC3.12), PWR_Stage (C7.2 R45.1)
i_adc2: CPCIS_PWR_MOD_DC (IC3.7), PWR_Stage (C17.2 R34.1)
PS-ON: CPCIS_PWR_MOD_DC (IC3.38 R19.1 T1.3), PWR_Stage (T6.1)
RTN_Sense: CPCIS_PWR_MOD_DC (J2.A2), PWR_Stage (10 pins)
v_adc1: CPCIS_PWR_MOD_DC (IC3.11), PWR_Stage (C23.2 R65.2 R72.2)
v_adc2: CPCIS_PWR_MOD_DC (IC3.8), PWR_Stage (C12.2 R33.2 R156.2)